# EAGLE schematic development board (EAGLE 6.3)
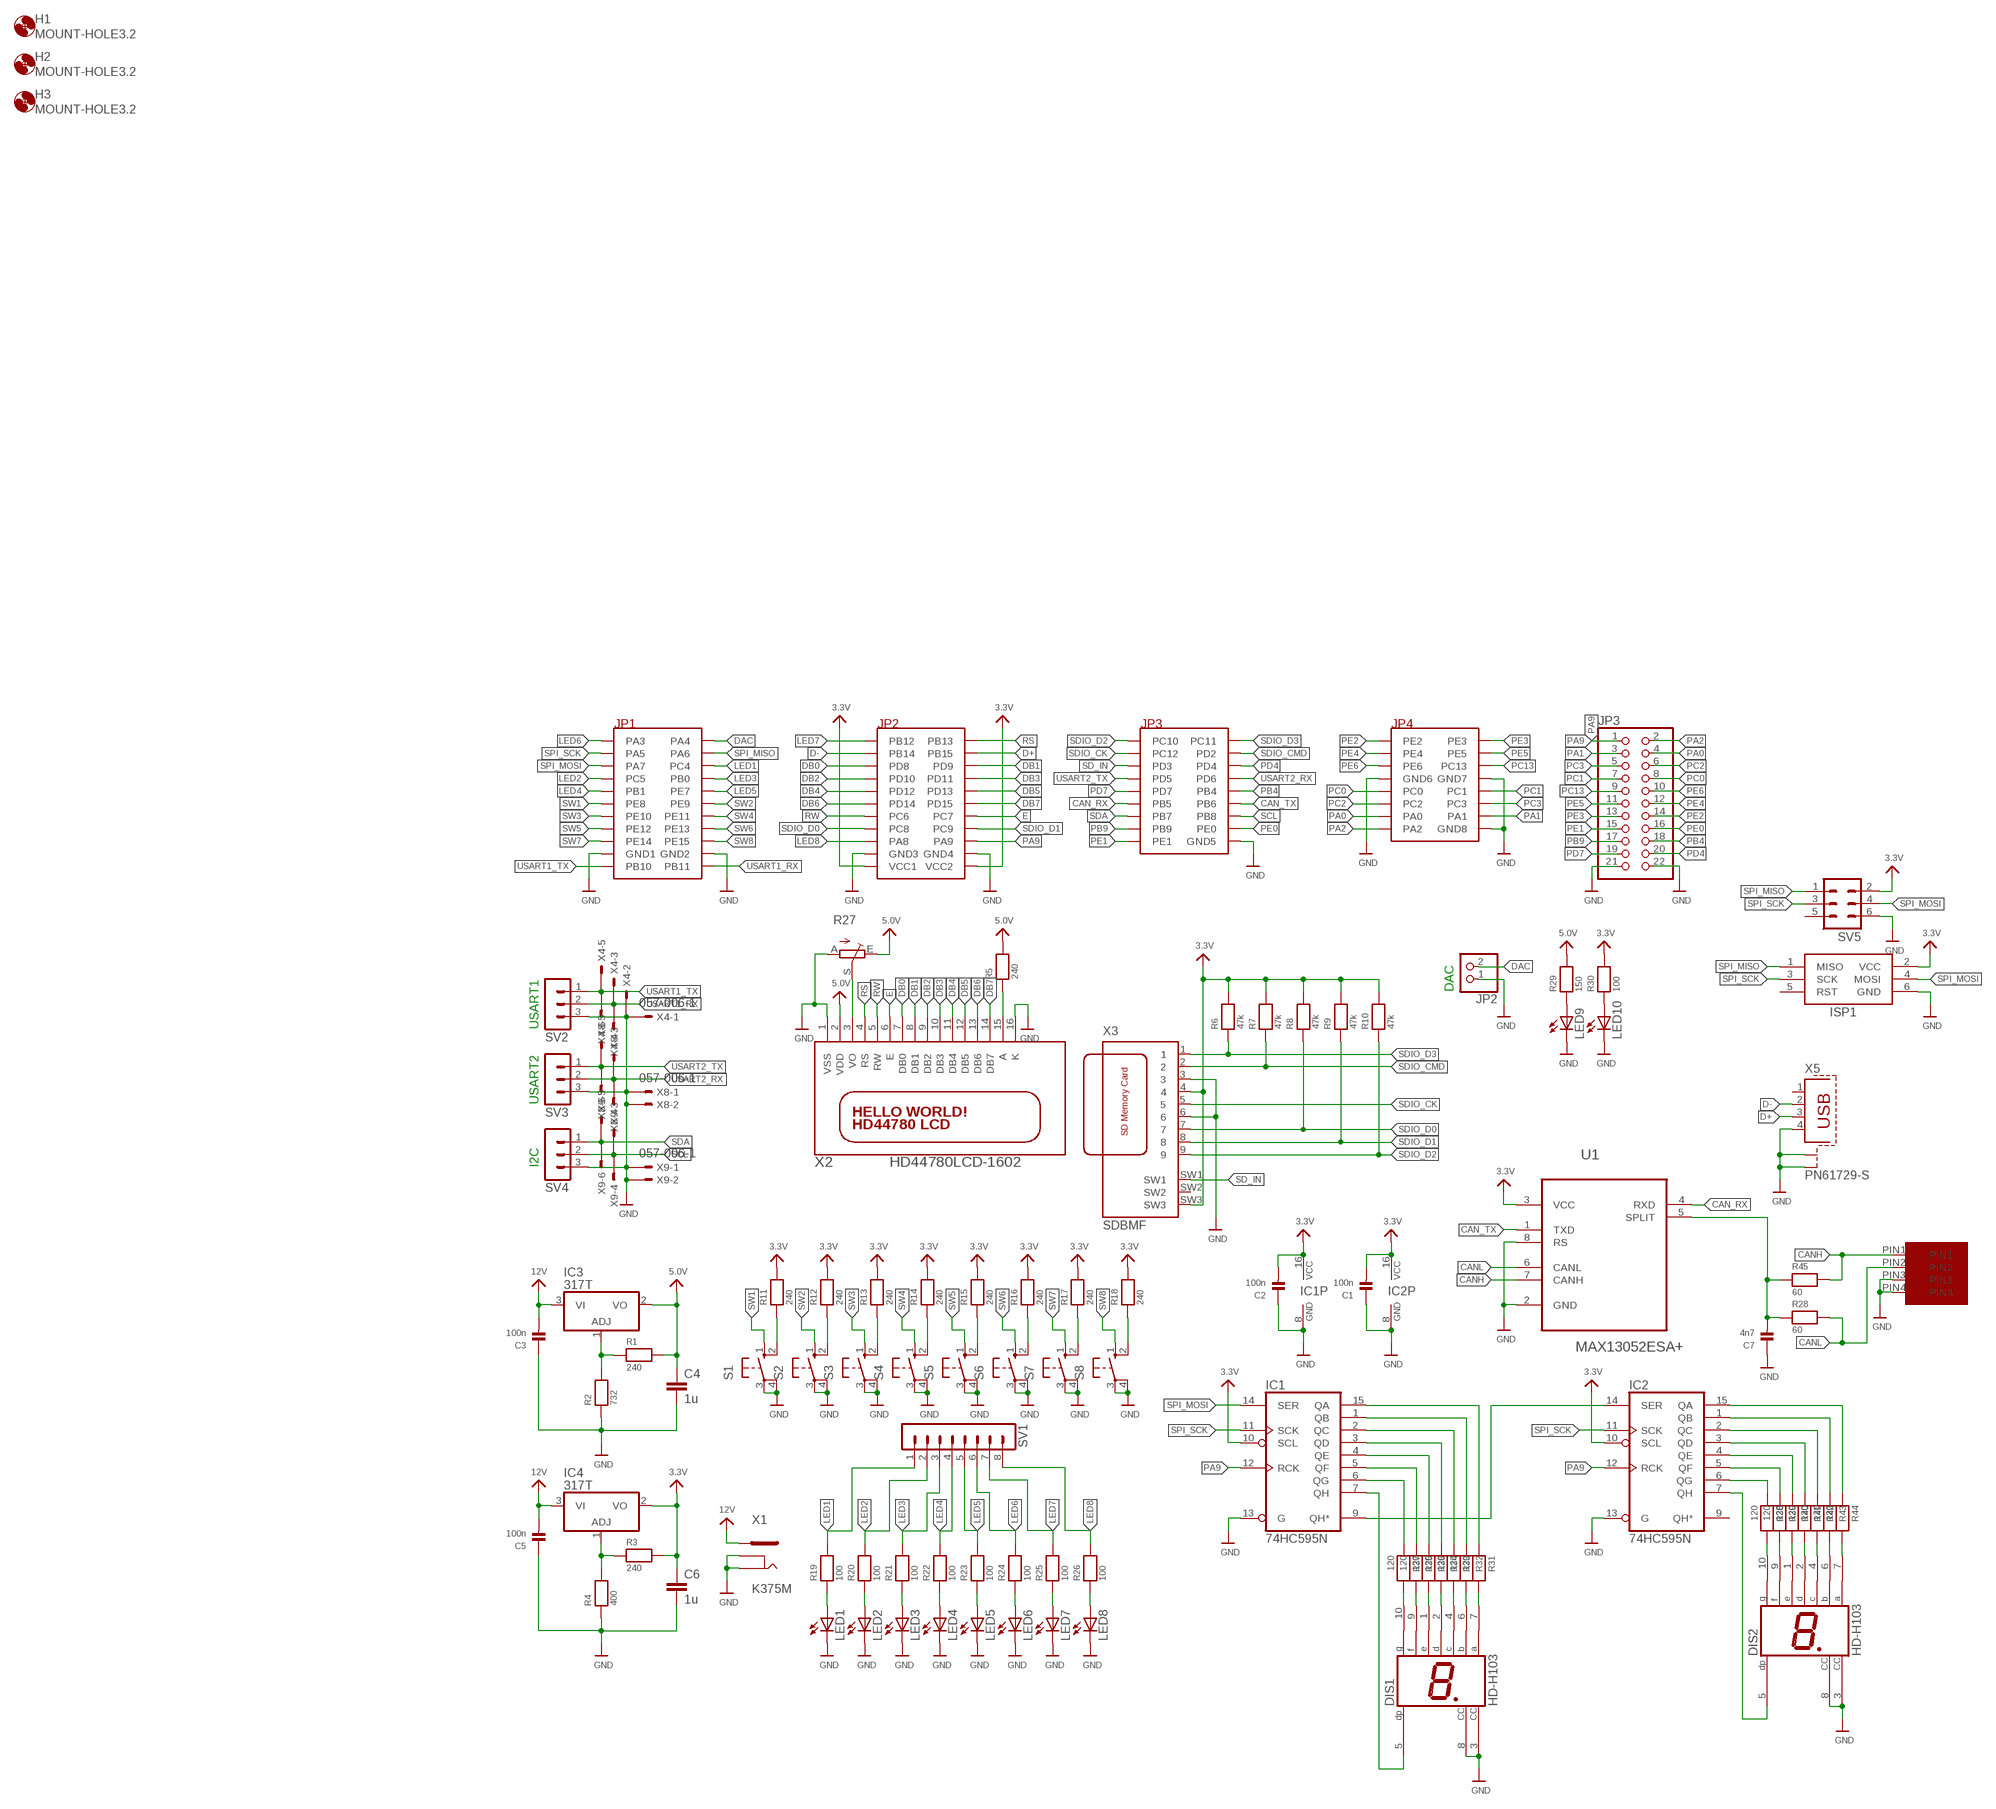
[diagram p0: schematic, sheet 1]

## Parts
C1  100n  CAP_CERAMIC_0603  [_0603]
C2  100n  CAP_CERAMIC_0603  [_0603]
C3  100n  CAP_CERAMIC_0603  [_0603]
C4  1u  C-EU050-035X075  [C050-035X075]
C5  100n  CAP_CERAMIC_0603  [_0603]
C6  1u  C-EU050-035X075  [C050-035X075]
C7  4n7  CAP_CERAMIC_0603  [_0603]
DIS1  HD-H103  [HDSP-M]
DIS2  HD-H103  [HDSP-M]
H1  MOUNT-HOLE3.2  [3,2]
H2  MOUNT-HOLE3.2  [3,2]
H3  MOUNT-HOLE3.2  [3,2]
IC1  74HC595N  [DIL16]
IC2  74HC595N  [DIL16]
IC3  317T  [TO220H]
IC4  317T  [TO220H]
ISP1  AVRISP-BOX  [AVRISP-BOX]
JP2  HEADER-1X2ROUND  [1X02_ROUND]
JP3  PINHD-2X11  [2X11]
LED1  LED5MM  [LED5MM]
LED2  LED5MM  [LED5MM]
LED3  LED5MM  [LED5MM]
LED4  LED5MM  [LED5MM]
LED5  LED5MM  [LED5MM]
LED6  LED5MM  [LED5MM]
LED7  LED5MM  [LED5MM]
LED8  LED5MM  [LED5MM]
LED9  LED3MM  [LED3MM]
LED10  LED3MM  [LED3MM]
R1  240  RESISTOR_0603  [_0603]
R2  732  RESISTOR_0603  [_0603]
R3  240  RESISTOR_0603  [_0603]
R4  400  RESISTOR_0603  [_0603]
R5  240  RESISTOR_0603  [_0603]
R6  47k  RESISTOR_0603  [_0603]
R7  47k  RESISTOR_0603  [_0603]
R8  47k  RESISTOR_0603  [_0603]
R9  47k  RESISTOR_0603  [_0603]
R10  47k  RESISTOR_0603  [_0603]
R11  240  RESISTOR_0603  [_0603]
R12  240  RESISTOR_0603  [_0603]
R13  240  RESISTOR_0603  [_0603]
R14  240  RESISTOR_0603  [_0603]
R15  240  RESISTOR_0603  [_0603]
R16  240  RESISTOR_0603  [_0603]
R17  240  RESISTOR_0603  [_0603]
R18  240  RESISTOR_0603  [_0603]
R19  100  RESISTOR_0603  [_0603]
R20  100  RESISTOR_0603  [_0603]
R21  100  RESISTOR_0603  [_0603]
R22  100  RESISTOR_0603  [_0603]
R23  100  RESISTOR_0603  [_0603]
R24  100  RESISTOR_0603  [_0603]
R25  100  RESISTOR_0603  [_0603]
R26  100  RESISTOR_0603  [_0603]
R27  TRIM_EU-RJ9W  [RJ9W]
R28  60  RESISTOR_0603  [_0603]
R29  150  RESISTOR_0603  [_0603]
R30  100  RESISTOR_0603  [_0603]
R31  120  RESISTOR_0603  [_0603]
R32  120  RESISTOR_0603  [_0603]
R33  120  RESISTOR_0603  [_0603]
R34  120  RESISTOR_0603  [_0603]
R35  120  RESISTOR_0603  [_0603]
R36  120  RESISTOR_0603  [_0603]
R37  120  RESISTOR_0603  [_0603]
R38  120  RESISTOR_0603  [_0603]
R39  120  RESISTOR_0603  [_0603]
R40  120  RESISTOR_0603  [_0603]
R41  120  RESISTOR_0603  [_0603]
R42  120  RESISTOR_0603  [_0603]
R43  120  RESISTOR_0603  [_0603]
R44  120  RESISTOR_0603  [_0603]
R45  60  RESISTOR_0603  [_0603]
S1  10-XX  [B3F-10XX]
S2  10-XX  [B3F-10XX]
S3  10-XX  [B3F-10XX]
S4  10-XX  [B3F-10XX]
S5  10-XX  [B3F-10XX]
S6  10-XX  [B3F-10XX]
S7  10-XX  [B3F-10XX]
S8  10-XX  [B3F-10XX]
SV1  MA08-1  [MA08-1]
SV2  MA03-1  [MA03-1]
SV3  MA03-1  [MA03-1]
SV4  MA03-1  [MA03-1]
SV5  MA03-2  [MA03-2]
U1  MAX13052ESA+  [SOIC127P600X175-8N]
U$1  CPU-BOARD  [CPU-BOARD-JP1]
U$57  MICROFIT4  [MICROFIT4SOCK]
X1  K375M  [K375M]
X2  HD44780LCD-1602  [LCD1602]
X3  SDBMF  [SDBMF-009XXBXX2]
X4  057-006-1  [057-006-1]
X5  PN61729-S  [PN61729-S]
X8  057-006-1  [057-006-1]
X9  057-006-1  [057-006-1]

## Nets
3.3V: C1.2 C2.2 C6.1 IC1.10(SCL) IC1.16(VCC) IC2.10(SCL) IC2.16(VCC) IC4.2(VO) ISP1.2(VCC) R3.2 R6.2 R7.2 R8.2 R9.2 R10.2 R11.2 R12.2 R13.2 R14.2 R15.2 R16.2 R17.2 R18.2 R30.2 SV5.2 U1.3(VCC) U$1.P$43(VCC1) U$1.P$44(VCC2) X3.4 X3.SW3
5.0V: C4.1 IC3.2(VO) R1.2 R5.2 R27.E R29.2 X2.2(VDD)
12V: C3.2 C5.2 IC3.3(VI) IC4.3(VI) X1.1
CAN_RX: U1.4(RXD) U$1.P$55(PB5)
CAN_TX: U1.1(TXD) U$1.P$56(PB6)
CANH: R45.2 U1.7(CANH) U$57.PIN1
CANL: R28.2 U1.6(CANL) U$57.PIN2
D+: U$1.P$26(PB15) X5.3
D-: U$1.P$25(PB14) X5.2
DAC: JP2.2 U$1.P$2(PA4)
DB0: U$1.P$27(PD8) X2.7(DB0)
DB1: U$1.P$28(PD9) X2.8(DB1)
DB2: U$1.P$29(PD10) X2.9(DB2)
DB3: U$1.P$30(PD11) X2.10(DB3)
DB4: U$1.P$31(PD12) X2.11(DB4)
DB5: U$1.P$32(PD13) X2.12(DB5)
DB6: U$1.P$33(PD14) X2.13(DB6)
DB7: U$1.P$34(PD15) X2.14(DB7)
E: U$1.P$36(PC7) X2.6(E)
GND: C1.1 C2.1 C3.1 C4.2 C5.1 C6.2 C7.1 DIS1.3(CC) DIS1.8(CC) DIS2.3(CC) DIS2.8(CC) IC1.8(GND) IC1.13(G) IC2.8(GND) IC2.13(G) ISP1.6(GND) JP2.1 JP3.21 JP3.22 LED1.K(C) LED2.K(C) LED3.K(C) LED4.K(C) LED5.K(C) LED6.K(C) LED7.K(C) LED8.K(C) LED9.K(C) LED10.K(C) R2.1 R4.1 R27.A S1.3(P) S1.4(P1) S2.3(P) S2.4(P1) S3.3(P) S3.4(P1) S4.3(P) S4.4(P1) S5.3(P) S5.4(P1) S6.3(P) S6.4(P1) S7.3(P) S7.4(P1) S8.3(P) S8.4(P1) SV2.3 SV3.3 SV4.3 SV5.6 U1.2(GND) U1.8(RS) U$1.P$21(GND1) U$1.P$22(GND2) U$1.P$41(GND3) U$1.P$42(GND4) U$1.P$62(GND5) U$1.P$69(GND6) U$1.P$70(GND7) U$1.P$78(GND8) U$57.PIN3 U$57.PIN4 X1.2 X1.3 X2.1(VSS) X2.16(K) X3.3 X3.6 X4.1 X4.2 X5.4 X5.S1 X5.S2 X8.1 X8.2 X9.1 X9.2
LED1: R19.2 SV1.1 U$1.P$6(PC4)
LED2: R20.2 SV1.2 U$1.P$7(PC5)
LED3: R21.2 SV1.3 U$1.P$8(PB0)
LED4: R22.2 SV1.4 U$1.P$9(PB1)
LED5: R23.2 SV1.5 U$1.P$10(PE7)
LED6: R24.2 SV1.6 U$1.P$1(PA3)
LED7: R25.2 SV1.7 U$1.P$23(PB12)
LED8: R26.2 SV1.8 U$1.P$39(PA8)
N$1: DIS2.5(DP) IC2.7(QH)
N$2: IC2.6(QG) R38.1
N$3: IC2.5(QF) R39.1
N$4: IC2.4(QE) R40.1
N$5: IC2.3(QD) R41.1
N$6: IC2.2(QC) R42.1
N$7: IC2.1(QB) R43.1
N$8: IC2.15(QA) R44.1
N$9: IC1.9(QH*) IC2.14(SER)
N$10: DIS1.5(DP) IC1.7(QH)
N$11: IC1.6(QG) R37.1
N$12: IC1.5(QF) R35.1
N$13: IC1.4(QE) R36.1
N$14: IC1.3(QD) R34.1
N$15: IC1.2(QC) R33.1
N$16: IC1.1(QB) R32.1
N$17: IC1.15(QA) R31.1
N$18: R5.1 X2.15(A)
N$19: R11.1 S1.2(S1)
N$20: LED10.A R30.1
N$21: R12.1 S2.2(S1)
N$22: IC3.1(ADJ) R1.1 R2.2
N$23: R13.1 S3.2(S1)
N$24: IC4.1(ADJ) R3.1 R4.2
N$25: R14.1 S4.2(S1)
N$26: R15.1 S5.2(S1)
N$27: R16.1 S6.2(S1)
N$28: R17.1 S7.2(S1)
N$29: R18.1 S8.2(S1)
N$30: LED1.A R19.1
N$31: LED9.A R29.1
N$32: LED2.A R20.1
N$34: LED3.A R21.1
N$36: LED4.A R22.1
N$38: LED5.A R23.1
N$40: LED6.A R24.1
N$42: LED7.A R25.1
N$44: LED8.A R26.1
N$51: DIS1.7(A) R31.2
N$52: DIS1.6(B) R32.2
N$60: DIS1.4(C) R33.2
N$61: DIS1.2(D) R34.2
N$62: DIS1.9(F) R35.2
N$63: DIS1.1(E) R36.2
N$64: DIS1.10(G) R37.2
N$65: DIS2.10(G) R38.2
N$66: DIS2.9(F) R39.2
N$67: DIS2.1(E) R40.2
N$68: DIS2.2(D) R41.2
N$69: DIS2.4(C) R42.2
N$70: DIS2.6(B) R43.2
N$71: DIS2.7(A) R44.2
N$72: C7.2 R28.1 R45.1 U1.5(SPLIT)
PA0: JP3.4 U$1.P$75(PA0)
PA1: JP3.3 U$1.P$76(PA1)
PA2: JP3.2 U$1.P$77(PA2)
PA9: IC1.12(RCK) IC2.12(RCK) JP3.1 U$1.P$40(PA9)
PB4: JP3.18 U$1.P$54(PB4)
PB9: JP3.17 U$1.P$59(PB9)
PC0: JP3.8 U$1.P$71(PC0)
PC1: JP3.7 U$1.P$72(PC1)
PC2: JP3.6 U$1.P$73(PC2)
PC3: JP3.5 U$1.P$74(PC3)
PC13: JP3.9 U$1.P$68(PC13)
PD4: JP3.20 U$1.P$50(PD4)
PD7: JP3.19 U$1.P$53(PD7)
PE0: JP3.16 U$1.P$60(PE0)
PE1: JP3.15 U$1.P$61(PE1)
PE2: JP3.14 U$1.P$63(PE2)
PE3: JP3.13 U$1.P$64(PE3)
PE4: JP3.12 U$1.P$65(PE4)
PE5: JP3.11 U$1.P$66(PE5)
PE6: JP3.10 U$1.P$67(PE6)
RS: U$1.P$24(PB13) X2.4(RS)
RW: U$1.P$35(PC6) X2.5(RW)
SCL: SV4.2 U$1.P$58(PB8) X9.3 X9.4
SD_IN: U$1.P$49(PD3) X3.SW1
SDA: SV4.1 U$1.P$57(PB7) X9.5 X9.6
SDIO_CK: U$1.P$47(PC12) X3.5
SDIO_CMD: R7.1 U$1.P$48(PD2) X3.2
SDIO_D0: R8.1 U$1.P$37(PC8) X3.7
SDIO_D1: R9.1 U$1.P$38(PC9) X3.8
SDIO_D2: R10.1 U$1.P$45(PC10) X3.9
SDIO_D3: R6.1 U$1.P$46(PC11) X3.1
SPI_MISO: ISP1.1(MISO) SV5.1 U$1.P$4(PA6)
SPI_MOSI: IC1.14(SER) ISP1.4(MOSI) SV5.4 U$1.P$5(PA7)
SPI_SCK: IC1.11(SCK) IC2.11(SCK) ISP1.3(SCK) SV5.3 U$1.P$3(PA5)
SW1: S1.1(S) U$1.P$11(PE8)
SW2: S2.1(S) U$1.P$12(PE9)
SW3: S3.1(S) U$1.P$13(PE10)
SW4: S4.1(S) U$1.P$14(PE11)
SW5: S5.1(S) U$1.P$15(PE12)
SW6: S6.1(S) U$1.P$16(PE13)
SW7: S7.1(S) U$1.P$17(PE14)
SW8: S8.1(S) U$1.P$18(PE15)
USART1_RX: SV2.2 U$1.P$20(PB11) X4.3 X4.4
USART1_TX: SV2.1 U$1.P$19(PB10) X4.5 X4.6
USART2_RX: SV3.2 U$1.P$52(PD6) X8.3 X8.4
USART2_TX: SV3.1 U$1.P$51(PD5) X8.5 X8.6
VO: R27.S X2.3(VO)
Unconnected: IC2.9(QH*) ISP1.5(RST) SV5.5 X3.SW2 X5.1

## Notes on the sheet
- DAC
- USART1
- USART2
- I2C

## Library data of the parts
C1-C3 C5 C7 = microbuilder:CAP_CERAMIC: Ceramic Capacitors 0402 - 0402 Surface Mount Capacitors 16pF 50V 5% [Digikey: 445-4899-2-ND] 18pF 50V 5% [Digikey: 490-1281-2-ND] 22pF 50V 5% [Digikey: 490-1283-2-ND] 68pF 50V 5% [Digikey: 490-1289-2-ND] 0.1uF 10V 10% [Digikey: 490-1318-2-ND] 1.0uF 6.3V 10% [Digikey: 490-1320-2-ND] 0603 - 0603 Surface Mount Capacitors 16 pF 50V 5% [Digikey: 445-5051-2-ND] 22 pF 50V [Digikey: PCC220ACVTR-ND] 33 pF 50V 5% [Digikey: 490-1415-1-ND] 56pF 50V 5% [Digikey: 490-1421-1-ND] 220pF 50V 5% [Digikey: 445-1285-1-ND] 680 pF 50V 2200 pF 50V 5% C0G [Digikey: 445-1297-1-ND] 5600 pF 100V 5% X7R [Digikey: 478-3711-1-ND] 0.1 µF 25V 10% [Digikey: PCC2277TR-ND] 0.22 µF 16V 10% X7R [Digikey: 445-1318-1-ND] 1.0 µF 25V 10% [Digikey: 445-5146-2-ND] 0603 - RF Specific 3pF 250V +/-0.1pF RF [Digikey: 712-1347-1-ND] 18 pF 250V 5% [Digikey: 478-3505-1-ND or 712-1322-1-ND] 56 pF 250V 5% C0G RF [Digikey: 490-4867-1-ND] 68 pF 250V RF [Digikey: 490-4868-1-ND] 0805 - 0805 Surface Mount Capacitors 220 pF 250V 2% RF Ceramic Capacitor [Digikey: 712-1398-1-ND] 1000 pF 50V 2% NP0 Ceramic Capacitor [Digikey: 478-3760-1-ND] 0.1 µF 25V 10% Ceramic Capacitor [Digikey: PCC1828TR-ND] 1.0 µF 16V 10% Ceramic Capacitor[Digikey: 490-1691-2-ND] 10.0 µF 10V 10% Ceramic Capacitor[Digikey: 709-1228-1-ND] 10.0 uF 16V 10% Ceramic Capacitor [Digikey: 478-5165-2-ND] 47 uF 6.3V 20% Ceramic Capacitor [Digikey: 587-1779-1-ND or 399-5506-1-ND] 1206 - 1206 Surface Mount Capacitors 47uF 10V 20% Ceramic Capacitor [Digikey: 490-5528-1-ND or 399-5508-1-ND or 445-6010-1-ND] 100uF 6.3V -20%, +80% Y5V Ceramic Capacitor (Digikey: 490-4512-1-ND, Mouser: 81-GRM31CF50J107ZE1L)
C4 C6 = rcl:C-EU: CAPACITOR, European symbol
DIS1 DIS2 = display-hp:HD-H103: LED DISPLAY 1-character 7 segment, decimal point right; OC_FARNELL: unknown; OC_NEWARK: unknown
H1-H3 = holes:MOUNT-HOLE: MOUNTING HOLE with drill center marker
IC1 IC2 = 74xx-eu:74*595: 8-bit SHIFT REGISTER, output latch
IC3 IC4 = linear:*317: Positive VOLTAGE REGULATOR
ISP1 = adafruit:AVRISP: AVR ISP HEADER Standard 6 pin header for AVR programming
JP2 = microbuilder:HEADER-1X2: PIN HEADER
JP3 = pinhead:PINHD-2X11: PIN HEADER
LED1-LED8 = adafruit:LED: LED
LED9 LED10 = led:LED: LED
R1-R26 R28-R45 = microbuilder:RESISTOR: Resistors 0402 - 0402 Surface Mount Package 22 Ohm 1% 1/16W [Digikey: 311-22.0LRTR-ND] 33 Ohm 5% 1/16W 1.0K 5% 1/16W 1.5K 5% 1/16W 2.0K 1% 1/16W 10.0K 1% 1/16W [Digikey: 311-10.0KLRTR-ND] 10.0K 5% 1/16W [Digikey: RMCF0402JT10K0TR-ND] 12.1K 1% 1/16W [Digikey: 311-22.0LRTR-ND] 100.0K 5% 1/16W 0603 - 0603 Surface Mount Package 0 Ohm 1/10 Watt 1% Resistor 15 Ohm 1/10 Watt 1% Resistor 33 Ohm 1/10 Watt 1% Resistor 49.9 Ohm 1/10 Watt 1% Resistor 100 Ohm 1/10 Watt 1% Resistor 150 Ohm 1/10 Watt 1% Resistor 240 Ohm 1/10 Watt 1% Resistor 390 Ohm 1/10 Watt 1% Resistor 560 Ohm 1/10 Watt 1% Resistor 680 Ohm 1/10 Watt 1% Resistor 750 Ohm 1/10 Watt 1% Resistor 1.0K Ohm 1/10 Watt 1% Resistor 1.5K Ohm 1/10 Watt 1% Resistor 2.0K Ohm 1/10 Watt 1% Resistor 2.2K Ohm 1/10 Watt 1% Resistor 3.3K Ohm 1/10 Watt 1% Resistor 4.7K Ohm 1/10 Watt 1% Resistor 10.0K Ohm 1/10 Watt 1% Resistor 12.0K Ohm 1/10 Watt 1% Resistor 12.1K Ohm 1/10 Watt 1% Resistor 20.0K Ohm 1/10 Watt 1% Resistor 33.0K Ohm 1/10 Watt 1% Resistor 100.0K Ohm 1/10 Watt 1% Resistor 0805 - 0805 Surface Mount Package 0 Ohm 1/8 Watt 1% Resistor 33 Ohm 1/8 Watt 1% Resistor 100 Ohm 1/8 Watt 1% Resistor 150 Ohm 1/8 Watt 1% Resistor 200 Ohm 1/8 Watt 1% Resistor 240 Ohm 1/8 Watt 1% Resistor 330 Ohm 1/8 Watt 1% Resistor 390 Ohm 1/8 Watt 1% Resistor 470 Ohm 1/8 Watt 1% Resistor 1.0K Ohm 1/8 Watt 1% Resistor 1.5K Ohm 1/8 Watt 1% Resistor 2.0K Ohm 1/8 Watt 1% Resistor 4.7K Ohm 1/8 Watt 1% Resistor 5.1K Ohm 1/8 Watt 1% Resistor 5.6K Ohm 1/8 Watt 1% Resistor 10.0K Ohm 1/8 Watt 1% Resistor 22.0K Ohm 1/8 Watt 1% Resistor 33.0K Ohm 1/8 Watt 1% Resistor 100K Ohm 1/8 Watt 1% Resistor 1206 - 1206 Surface Mount Package 2012 - 2010 Surface Mount Package 0.11 Ohm 1/2 Watt 1% Resistor - Digikey: RHM.11UCT-ND
R27 = pot:TRIM_EU-: POTENTIOMETER
S1-S8 = switch-omron:10-XX: OMRON SWITCH; MPN: B3F-1000; OC_FARNELL: 176432; OC_NEWARK: 36M3542
SV1 = con-lstb:MA08-1: PIN HEADER; OC_FARNELL: unknown; OC_NEWARK: unknown
SV2-SV4 = con-lstb:MA03-1: PIN HEADER; OC_FARNELL: unknown; OC_NEWARK: unknown
SV5 = con-lstb:MA03-2: PIN HEADER; OC_FARNELL: unknown; OC_NEWARK: unknown
U1 = Maxim_By_element14_Batch_1:MAX13052ESA+: Industry-Standard High-Speed CAN Transceivers with ±80V Fault Protection; MPN: MAX13052ESA+; OC_FARNELL: 1600112; OC_NEWARK: 99K2875; PACKAGE: SOIC-8; SUPPLIER: Maxim
U$1 = unicorn_v2:CPU-BOARD
U$57 = unicorn:MICROFIT4
X1 = con-shallin:K375M: K375M - DC POWER JACK 2.5mm/CENTRAL PIN Source: Data sheet <http://www.shallin.com/productview.aspx?itemnumber=K375M>
X2 = adafruit:HD44780LCD: HD44780 LCD Standard character type LCDs, available in sizes from 8x1 to 40x4!
X3 = farnell:SDBMF: SD MEMORY CARD PUSH-PUSH WITH CONNECTOR TYPE B (BIG SWUÌTCH #3) KINGFONT PRECISION INDUSTIAL CO., LTD Source: http://www.farnell.com/datasheets/74273.pdf Best.-Nr.: 9186174 Hersteller: MULTICOMP Herstellerbez.: SDBMF-00915B0T2
X4 X8 X9 = con-panduit:057-006-: CONNECTOR 6-pin series 057 contact pc board low profile headers; OC_FARNELL: unknown; OC_NEWARK: unknown
X5 = con-berg:PN61729-S: BERG USB connector; OC_FARNELL: unknown; OC_NEWARK: unknown